# EAGLE design digital_output_amp (EAGLE 9.3.2)
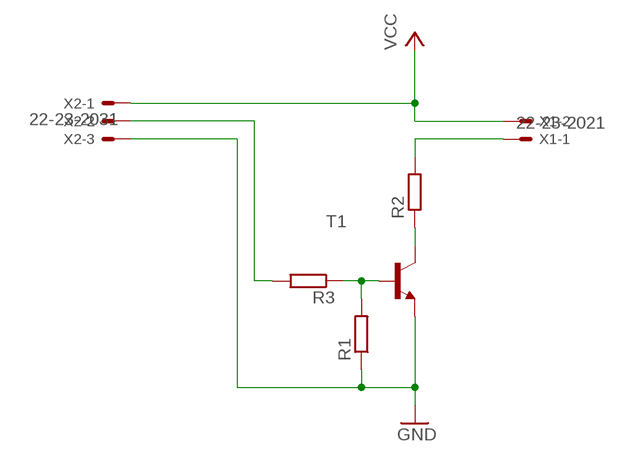
[diagram p0: schematic, sheet 1]

## Parts
R1  R-EU_M1206  [M1206]
R2  R-EU_M1206  [M1206]
R3  R-EU_M1206  [M1206]
T1  BC817-40-NPN-SOT23-BEC  [SOT23-BEC]
X1  22-23-2021  [22-23-2021]
X2  22-23-2031  [22-23-2031]

## Nets
GND: R1.1 T1.E X2.3
N$2: R2.2 X1.1
N$3: R2.1 T1.C
N$4: R1.2 R3.1 T1.B
N$6: R3.2 X2.2
VCC: X1.2 X2.1

## Library data of the parts
R1-R3 = rcl:R-EU_: RESISTOR, European symbol; SPICEPREFIX: R
T1 = transistor:*-NPN-: NPN Transistror BF959 corrected 2008.03.06
X1 = con-molex:22-23-2021: .100" (2.54mm) Center Header - 2 Pin; MF: MOLEX; MPN: 22-23-2021; OC_FARNELL: 1462926; OC_NEWARK: 25C3832
X2 = con-molex:22-23-2031: .100" (2.54mm) Center Header - 3 Pin; MF: MOLEX; MPN: 22-23-2031; OC_FARNELL: 1462950; OC_NEWARK: 30C0862

## Board
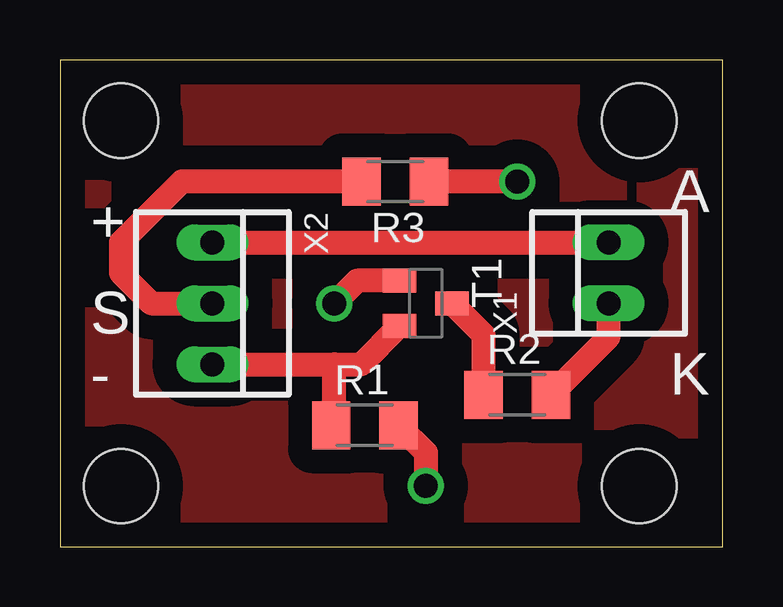
[diagram p1: board, top side]
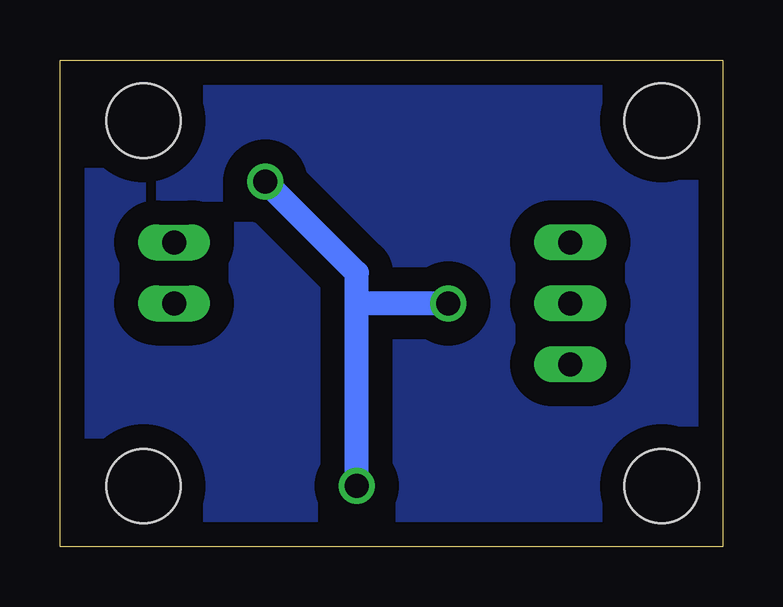
[diagram p2: board, bottom side, seen from below]

Size 27.61 x 20.31 mm. Coordinates in mm from the lower left corner, seen from the top.
Outline: 0,0 27.61,0 27.61,20.31 0,20.31 0,0
Copper layers (1*16): Top 0.035mm / dielectric 1.5mm / Bottom 0.035mm
Design rules "default": minimum track width 6mil, minimum drill 0.35mm, track to track 6mil, track to pad 6mil, pad to pad 6mil, via to via 6mil, smd to smd 6mil, copper to edge 40mil, drill to drill 6mil, minimum pad ring 10mil, minimum via ring 8mil, stop-mask expansion 4mil, vias tented up to drill 0mil, thermal gap 10mil
Holes 3.1 mm at 2.54,17.78 2.54,2.54 24.13,2.54 24.13,17.78

### Footprints (pad centres in the part's own frame; a part is rotated, then mirrored left to right if it is on the bottom)
M1206 = smd 1.6 x 2: 1 -1.4,0; 2 1.4,0
SOT23-BEC = smd 1 x 1.4: B -0.95,-1.1; C 0,1.1; E 0.95,-1.1
22-23-2021 = drill 1 long: 1 -1.27,0; 2 1.27,0
22-23-2031 = drill 1 long: 1 -2.54,0; 2 0,0; 3 2.54,0

### Placement (x,y rotation side)
R1  12.7,5.08 0 top
R2  19.05,6.35 0 top
R3  13.97,15.24 180 top
T1  15.24,10.16 270 top
X1  22.86,11.43 90 top
X2  6.35,10.16 270 top

### Tracks (layer width: path | path; a pad name or v marks a point on that pad's centre or on a via)
GND
  Top 1: T1.E 12.55,7.62 11.43,7.62 | X2.3 11.43,7.62 | R1.1 11.43,5.21 11.43,7.62
N$1
  pour Bottom (isolate 1): 0,20.32 27.94,20.32 27.94,0 0,0
N$2
  Top 1: R2.2 22.86,8.76 X1.1
N$3
  Top 1: R2.1 17.65,8.85 T1.C
N$4  (via drill 1)
  Top 1: R1.2 15.24,3.94 v15.24,2.54 | v19.05,15.24 R3.1 | T1.B 12.38,11.11 v11.43,10.16
  Bottom 1: v15.24,2.54 15.24,10.16 | 15.24,10.16 15.24,11.43 v19.05,15.24 | v11.43,10.16 15.24,10.16
N$5
  pour Top (isolate 1): 0,20.32 27.94,20.32 27.94,0 0,0
N$6
  Top 1: R3.2 5.08,15.24 2.54,12.7 2.54,11.43 3.81,10.16 X2.2
VCC
  Top 1: X2.1 X1.2

### Text on the board
tPlace: A | + | S | - | K